# Altium schematic sheet Darlington.SchDoc
size A4; SheetNumber: 1; SheetTotal: 1
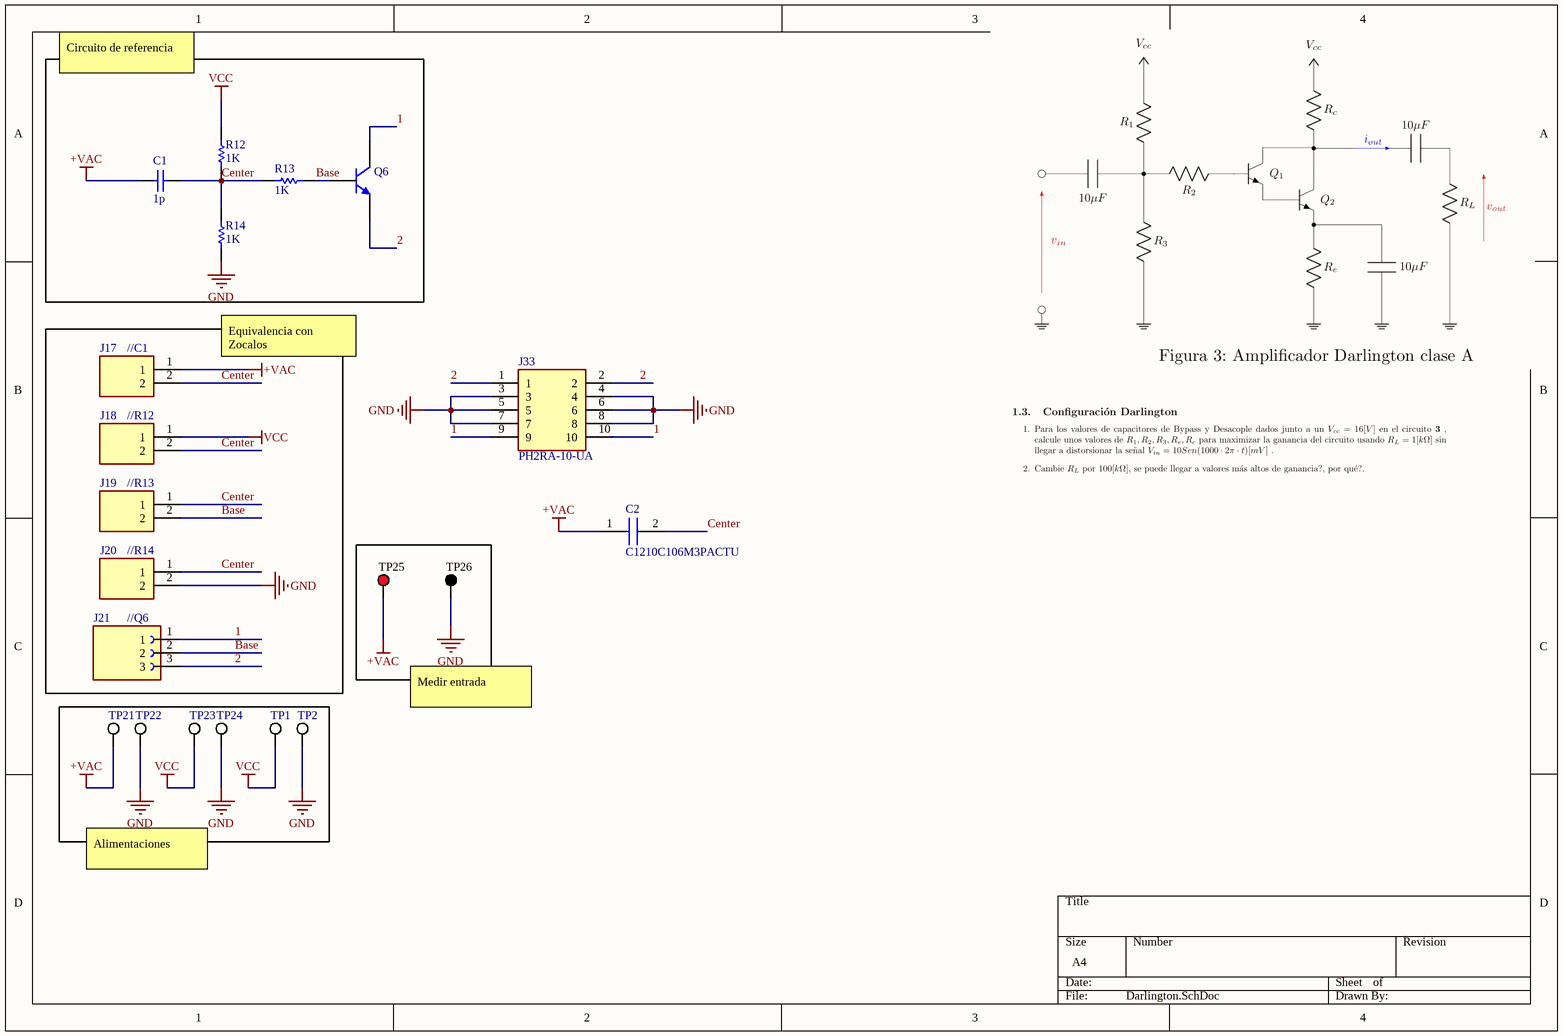
[diagram p0: Darlington.SchDoc]

## Parts
C1  value 1p  (hidden comment: Capacitor)
C2  C1210C106M3PACTU  [C1210]
J17  D01-9970242  [D019970242]  (value not drawn)
J18  D01-9970242  [D019970242]  (value not drawn)
J19  D01-9970242  [D019970242]  (value not drawn)
J20  D01-9970242  [D019970242]  (value not drawn)
J21  D01-9970342  [HARWIN_D01-9970342]  (value not drawn)
J33  PH2RA-10-UA  [HDRRA10W64P254_2X5_1270X250X538P]
Q6  Bipolar NPN 3 Pins Transistor VBIC Model  (value not drawn)
R12  value 1K  (hidden comment: Resistor)
R13  value 1K  (hidden comment: Resistor)
R14  value 1K  (hidden comment: Resistor)
TP1  575-4  [KSTN-575-4]  (value not drawn)
TP2  575-4  [KSTN-575-4]  (value not drawn)
TP21  575-4  [KSTN-575-4]  (value not drawn)
TP22  575-4  [KSTN-575-4]  (value not drawn)
TP23  575-4  [KSTN-575-4]  (value not drawn)
TP24  575-4  [KSTN-575-4]  (value not drawn)
TP25  5010  [KSTN-5010_V]  (value not drawn)
TP26  5011  [KSTN-5011_V]  (value not drawn)

## Nets
+VAC: C1.1 C2.1 J17.1 TP21.1 TP25.1
GND: J20.2 J33.3 J33.4 J33.5 J33.6 J33.7 J33.8 R14.1 TP2.1 TP22.1 TP24.1 TP26.1
VCC: J18.1 R12.1 TP1.1 TP23.1
1: J21.1 J33.9 J33.10 Q6.1(C)
2: J21.3 J33.1 J33.2 Q6.3(E)
Base: J19.2 J21.2 Q6.2(B) R13.2
Center: C1.2 C2.2 J17.2 J18.2 J19.1 J20.1 R12.2 R13.1 R14.2

## Notes on the sheet
- Circuito de referencia
- (near J17) //C1
- Equivalencia con Zocalos
- (near J18) //R12
- (near J19) //R13
- (near J20) //R14
- (near J21) //Q6
- Medir entrada
- Alimentaciones

## Library data of the parts
C1 = Capacitor: SimulationGenericComponent: True
C2 = C1210C106M3PACTU: Capacitor; Manufacturer_Name: Yageo Group; Datasheet Link: https://www.yageogroup.com/content/datasheet/asset/file/KEM_C1006_X5R_SMD; Manufacturer_Part_Number: C1210C106M3PACTU; Mouser Part Number: 80-C1210C106M3P; Mouser Price/Stock: https://www.mouser.com/Search/Refine.aspx?Keyword=80-C1210C106M3P
J17-J20 = D01-9970242: IC Socket: 2 Pos Receptacle SIL Straight THT Strip; Manufacturer_Name: Harwin; Geometry.Height: 4.2mm; Mouser Part Number: 855-D01-9970242; Mouser Price/Stock: https://www.mouser.co.uk/ProductDetail/Harwin/D01-9970242?qs=TpUtqFO9vU%252Bf37OJ5TYoTQ%3D%3D; Manufacturer_Part_Number: D01-9970242; Datasheet Link: https://content.harwin.com/m/e0b6c35948424a73/original/DRG-00097-Technical-Drawing-Datasheet-D01-997-pdf.pdf
J33 = PH2RA-10-UA: CONN HEADER R/A 10POS 2.54MM; Manufacturer_Name: Adam Tech; Geometry.Height: 5.381mm; Mouser Part Number: 737-PH2RA-10-UA; Mouser Price/Stock: https://www.mouser.co.uk/ProductDetail/Adam-Tech/PH2RA-10-UA?qs=HoCaDK9Nz5eXic%252Bmj6sc5g%3D%3D; Manufacturer_Part_Number: PH2RA-10-UA; Datasheet Link: https://app.adam-tech.com/products/download/data_sheet/200508/ph2ra-xx-ua-data-sheet.pdf
Q6 = BJT NPN VBIC: SimulationGenericComponent: True; AFN: 1; AJC: -0.5; ART: 0.1; AVC1: 0; EA: 1.12; FC: 0.9; IBBE: 1e-06; IBCI: 1e-16; IBEI: 1e-18; MC: 0.33; NCN: 2; NKF: 0.5; PC: 0.75; TNOM: 27; VERS: 1.2; XII: 3; AJE: -0.5; AJS: -0.5; AVC2: 0; BFN: 1; CBCO: 0; CBEO: 0; CCSO: 0; CJC: 0; CJCP: 0; CJE: 0; CJEP: 0; CTH: 0; DEAR: 0; EAIC: 1.12; EAIE: 1.12; EAIS: 1.12; EANC: 1.12; EANE: 1.12; EANS: 1.12; EAP: 1.12; EBBE: 0; GAMM: 0; HRCF: 1; IBCIP: 0; IBCN: 0; IBCNP: 0; IBEIP: 0; IBEN: 0; IBENP: 0; IKF: 0; IKP: 0; IKR: 0; IS: 1e-16; ISP: 0; ISRR: 1; ITF: 0; KFN: 0; ME: 0.33; MS: 0.33; NBBE: 1; NCI: 1; NCIP: 1; NCNP: 2; NEI: 1; NEN: 2; NF: 1; NFP: 1; NR: 1; PE: 0.75; PS: 0.75; QBM: 0; QCO: 0; QTF: 0; RBI: 0.1; RBP: 0.1; RBX: 0; RCI: 0.1; RCX: 0; RE: 0; RS: 0; RTH: 0; TAVC: 0; TD: 0; TF: 0; TNBBE: 0; TNF: 0; TR: 0; TVBBE1: 0; TVBBE2: 0; VBBE: 0; VEF: 0; VER: 0; VO: 0; VREF: 0; VRT: 0; VTF: 0; WBE: 1; WSP: 1; XIKF: 0; XIN: 3; XIS: 3; XISR: 0; XRBI: 0; XRBP: 0; XRBX: 0; XRCI: 0; XRCX: 0; XRE: 0; XRS: 0; XTF: 0; XVO: 0
R12-R14 = Resistor: TC1: 0; SimulationGenericComponent: True; TC2: 0
TP1 TP2 TP21-TP24 = CMP-2000-05649-1: Banana Jack, Non-Insulated, 1-Pin THD, RoHS, Bulk; Manufacturer: Keystone-Electronics; Package Version: Rev. B, 11/1994; Plug/Mating Plug Diameter: StandardBanana; Gender: Female; Package Reference: 575-4; Operating Temperature: -; Contact Material: Brass; Packaging: Bulk; Series: -; Category: Connectors,Interconnects; Color: -; Type: BananaJack; Contact Finish: Nickel; Features: -; Family: BananaandTipConnectors-Jacks,Plugs; Body Material: -; Manufacturer URL: http://www.keyelco.com/; Termination: Solder; Insulation: Non-Insulated; Datasheet Version: Rev. B, 11/1994; Mounting Technology: ThroughHole; Package URL: http://www.keyelco.com/product-pdf.cfm?p=2379; Mounting Type: ThroughHole; Package Description: 1-Pin Through Hole Device, Dia 7.92 mm; Datasheet URL: http://www.keyelco.com/product-pdf.cfm?p=2379; Wire Gauge: -
TP25 = CMP-1672-00002-4: Test Point, Red, Through Hole, RoHS, Bulk; Manufacturer: Keystone; Contact Material: Bronze; Mounting Technology: Through Hole; RoHSCompliant: true; Pins: 1; Package Quantity: 100; ComponentLink2Description: Datasheet; Height: 8.12 mm; ComponentLink1URL: http://www.keyelco.com/; DatasheetVersion: Rev. F, 12/2013; Mount: Through Hole; PackageReference: 5010; Contact Plating: Silver; Packaging: Bulk; Colour: Red; REACH SVHC: No SVHC; PackageDescription: 1-Pin Through Hole Device, Dia 3.17 mm; ComponentLink2URL: http://www.keyelco.com/product-pdf.cfm?p=1319; ComponentLink1Description: Manufacturer URL
TP26 = CMP-1672-00003-4: Test Point, Black, Through Hole, RoHS, Bulk; Manufacturer: Keystone; ComponentLink2URL: http://www.keyelco.com/product-pdf.cfm?p=1320; Colour: Black; Pins: 1; REACH SVHC: No SVHC; ComponentLink1URL: http://www.keyelco.com/; PackageReference: 5011; Contact Plating: Silver; Package Quantity: 100; Packaging: Bulk; RoHSCompliant: true; Height: 8.12 mm; PackageDescription: 1-Pin Through Hole Device, Dia 3.17 mm; Mount: Through Hole; Mounting Technology: Through Hole; DatasheetVersion: Rev. F, 12/2013; ComponentLink1Description: Manufacturer URL; Contact Material: Bronze; ComponentLink2Description: Datasheet
J21 = D01-9970342: Package: None; Price: None; Value: *; MP: D01-9970342; Availability: Unavailable